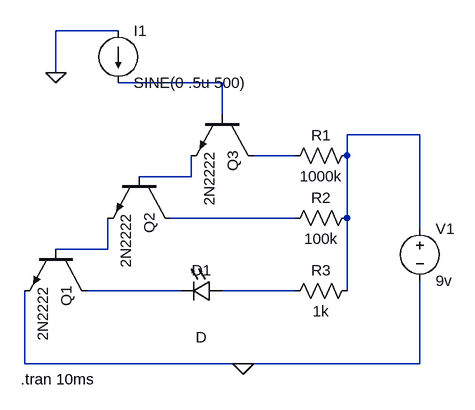
[diagram p0: schematic LT Spice simulation.asc]
LT Spice simulation.asc, the LTspice schematic file:
Version 4
SHEET 1 880 680
WIRE 144 -144 48 -144
WIRE 48 -80 48 -144
WIRE 304 -64 144 -64
WIRE 304 -16 304 -64
WIRE 608 16 496 16
WIRE 416 48 352 48
WIRE 496 48 496 16
WIRE 256 80 256 48
WIRE 256 80 176 80
WIRE 416 144 224 144
WIRE 496 144 496 48
WIRE 608 160 608 16
WIRE 128 192 128 144
WIRE 128 192 48 192
WIRE 240 256 96 256
WIRE 416 256 304 256
WIRE 496 256 496 144
WIRE 0 368 0 256
WIRE 336 368 0 368
WIRE 608 368 608 240
WIRE 608 368 336 368
FLAG 48 -80 0
FLAG 336 368 0
SYMBOL npn 96 192 R90
SYMATTR InstName Q1
SYMATTR Value 2N2222
SYMBOL npn 224 80 R90
SYMATTR InstName Q2
SYMATTR Value 2N2222
SYMBOL npn 352 -16 R90
SYMATTR InstName Q3
SYMATTR Value 2N2222
SYMBOL res 512 32 R90
WINDOW 0 0 56 VBottom 2
WINDOW 3 32 56 VTop 2
SYMATTR InstName R1
SYMATTR Value 1000k
SYMBOL res 512 128 R90
WINDOW 0 0 56 VBottom 2
WINDOW 3 32 56 VTop 2
SYMATTR InstName R2
SYMATTR Value 100k
SYMBOL LED 304 240 R90
WINDOW 0 0 32 VBottom 2
WINDOW 3 72 32 VTop 2
SYMATTR InstName D1
SYMBOL res 512 240 R90
WINDOW 0 0 56 VBottom 2
WINDOW 3 32 56 VTop 2
SYMATTR InstName R3
SYMATTR Value 1k
SYMBOL voltage 608 144 R0
WINDOW 123 0 0 Left 0
WINDOW 39 0 0 Left 0
SYMATTR InstName V1
SYMATTR Value 9v
SYMBOL current 144 -144 R0
WINDOW 123 0 0 Left 0
WINDOW 39 0 0 Left 0
SYMATTR InstName I1
SYMATTR Value SINE(0 .5u 500)
TEXT -6 392 Left 2 !.tran 10ms

The netlist it stands for:
* LT Spice simulation.asc
Q1 N007 N006 0 0 2N2222
Q2 N005 N004 N006 0 2N2222
Q3 N003 N001 N004 0 2N2222
R1 N002 N003 1000k
R2 N002 N005 100k
D1 N008 N007 D
R3 N002 N008 1k
V1 N002 0 9v
I1 0 N001 SINE(0 .5u 500)
.model D D
.lib standard.dio
.model NPN NPN
.model PNP PNP
.lib standard.bjt
.tran 10ms
.backanno
.end